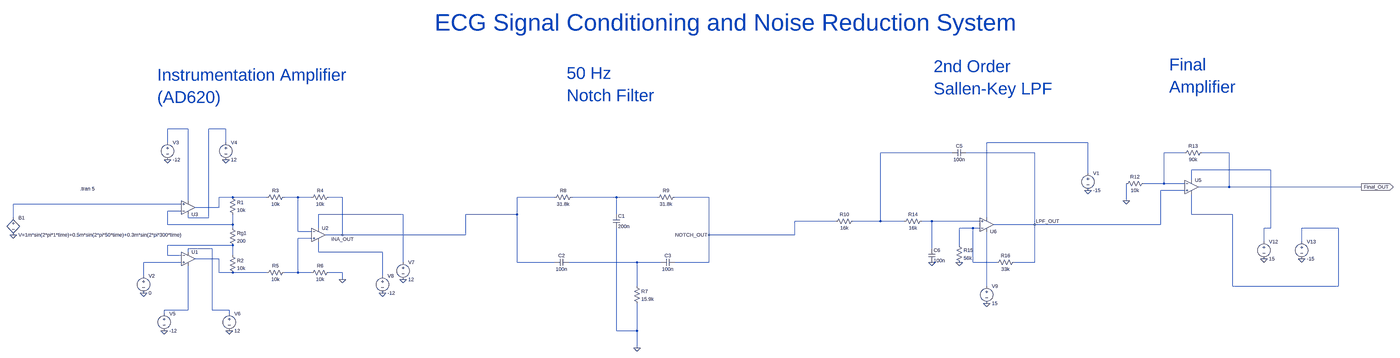
[diagram p0: schematic ECG_Final.asc, whole sheet]
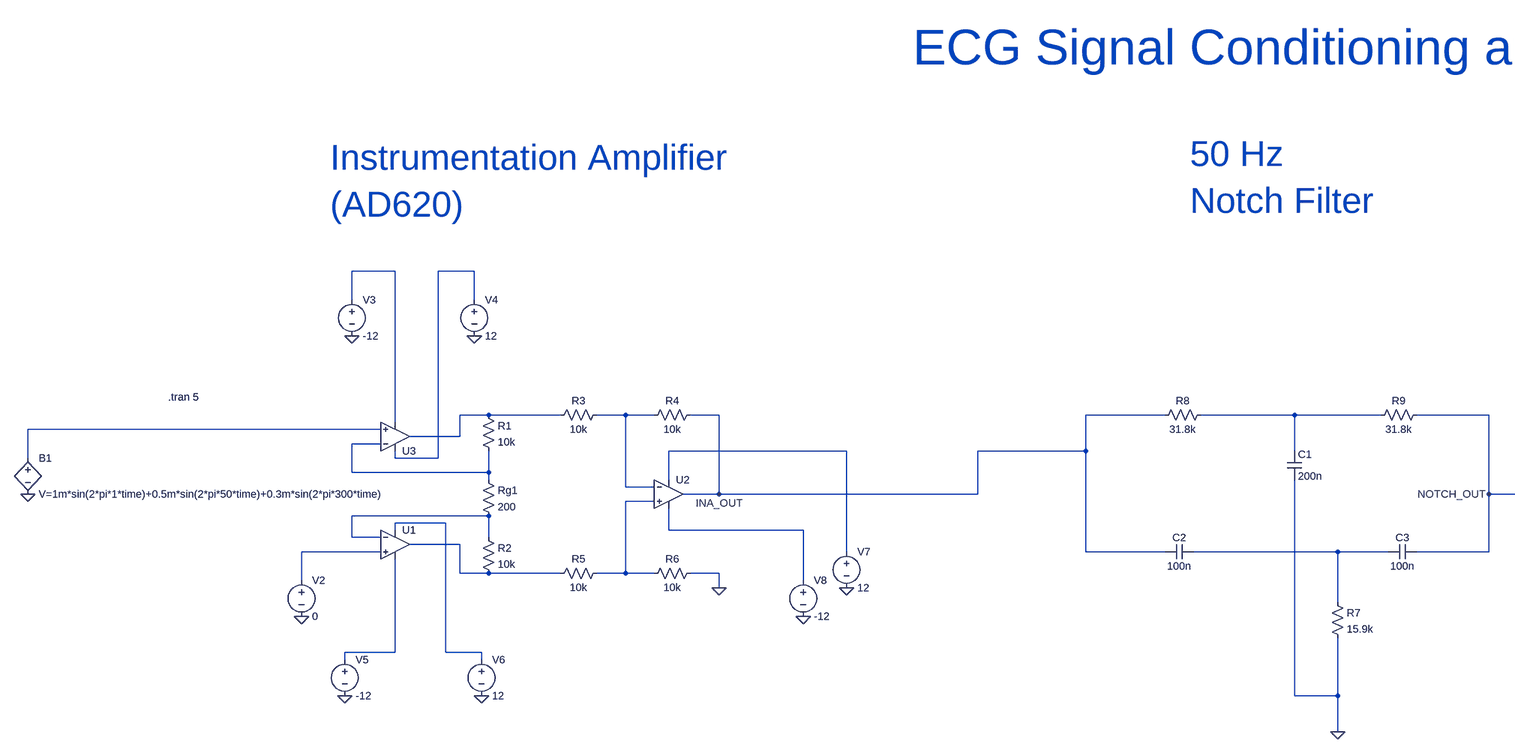
[diagram p1: schematic ECG_Final.asc, part, row 1 of 1, column 1 of 2]
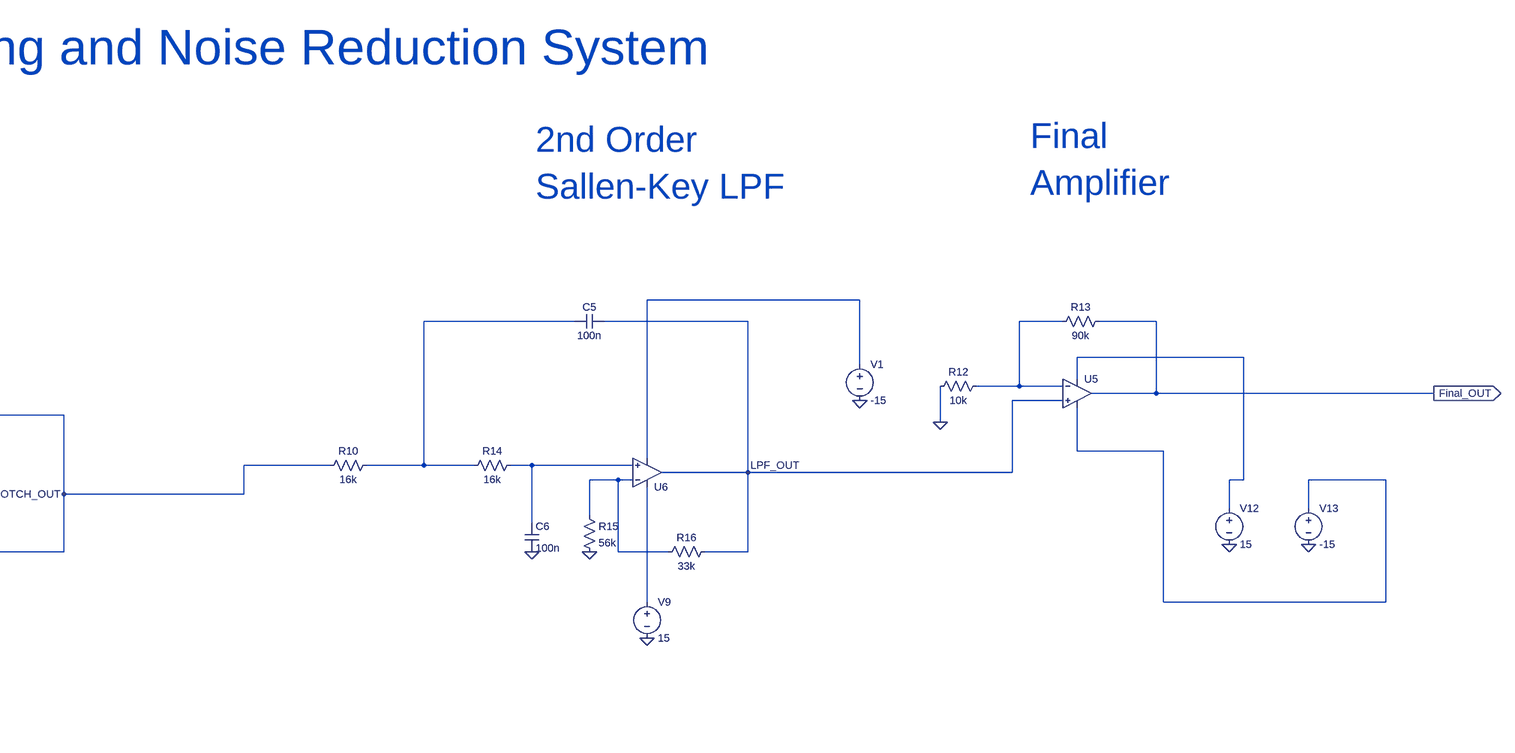
[diagram p2: schematic ECG_Final.asc, part, row 1 of 1, column 2 of 2]
ECG_Final.asc, the LTspice schematic file:
Version 4.1
SHEET 1 8388 680
WIRE -176 -368 -272 -368
WIRE 0 -368 -80 -368
WIRE -272 -304 -272 -368
WIRE 0 -304 0 -368
WIRE 4240 -304 3664 -304
WIRE 3504 -256 3168 -256
WIRE 3888 -256 3568 -256
WIRE 5056 -256 4960 -256
WIRE 5264 -256 5136 -256
WIRE 5488 -176 5088 -176
WIRE 4240 -160 4240 -304
WIRE 5088 -128 5088 -176
WIRE 4960 -112 4960 -256
WIRE 4960 -112 4864 -112
WIRE 5056 -112 4960 -112
WIRE 5264 -96 5264 -256
WIRE 5264 -96 5120 -96
WIRE 5952 -96 5264 -96
WIRE 5056 -80 4944 -80
WIRE 32 -48 -32 -48
WIRE 192 -48 32 -48
WIRE 336 -48 272 -48
WIRE 400 -48 336 -48
WIRE 544 -48 480 -48
WIRE 1648 -48 1472 -48
WIRE 1936 -48 1728 -48
WIRE 2128 -48 1936 -48
WIRE 2368 -48 2208 -48
WIRE -176 -32 -176 -368
WIRE 4784 -32 4784 -112
WIRE -208 -16 -992 -16
WIRE -32 0 -32 -48
WIRE -32 0 -144 0
WIRE -208 16 -272 16
WIRE 912 32 432 32
WIRE 1472 32 1472 -48
WIRE 1472 32 1232 32
WIRE 1936 32 1936 -48
WIRE 5088 32 5088 -64
WIRE 5280 32 5088 32
WIRE -992 48 -992 -16
WIRE -176 48 -176 32
WIRE -80 48 -80 -368
WIRE -80 48 -176 48
WIRE 3664 48 3664 -304
WIRE 2960 64 2768 64
WIRE 3168 64 3168 -256
WIRE 3168 64 3040 64
WIRE 3280 64 3168 64
WIRE 3408 64 3360 64
WIRE 3632 64 3408 64
WIRE -272 80 -272 16
WIRE 32 80 32 32
WIRE 32 80 -272 80
WIRE 3888 80 3888 -256
WIRE 3888 80 3696 80
WIRE 4944 80 4944 -80
WIRE 4944 80 3888 80
WIRE 32 96 32 80
WIRE 432 96 432 32
WIRE 3600 96 3536 96
WIRE 3632 96 3600 96
WIRE 5488 96 5488 -176
WIRE 5488 96 5456 96
WIRE 5824 96 5632 96
WIRE 336 112 336 -48
WIRE 400 112 336 112
WIRE 544 128 544 -48
WIRE 544 128 464 128
WIRE 1232 128 1232 32
WIRE 1232 128 544 128
WIRE 2368 128 2368 -48
WIRE 2768 128 2768 64
WIRE 2768 128 2368 128
WIRE 400 144 336 144
WIRE 5456 160 5456 96
WIRE 5632 160 5632 96
WIRE 32 176 -272 176
WIRE 3536 176 3536 96
WIRE -64 192 -176 192
WIRE 3408 192 3408 64
WIRE -176 208 -176 192
WIRE 432 208 432 160
WIRE 816 208 432 208
WIRE -272 224 -272 176
WIRE -208 224 -272 224
WIRE 32 224 32 176
WIRE -32 240 -144 240
WIRE -208 256 -384 256
WIRE 912 256 912 32
WIRE 1472 256 1472 32
WIRE 1648 256 1472 256
WIRE 2032 256 1712 256
WIRE 2144 256 2032 256
WIRE 2368 256 2368 128
WIRE 2368 256 2208 256
WIRE 3600 256 3600 96
WIRE 3712 256 3600 256
WIRE 3888 256 3888 80
WIRE 3888 256 3792 256
WIRE -32 304 -32 240
WIRE 32 304 -32 304
WIRE 192 304 32 304
WIRE 336 304 336 144
WIRE 336 304 272 304
WIRE 400 304 336 304
WIRE 544 304 480 304
WIRE -384 320 -384 256
WIRE 816 320 816 208
WIRE 544 336 544 304
WIRE 2032 368 2032 256
WIRE 3664 368 3664 112
WIRE 5280 368 5280 32
WIRE 5824 368 5824 96
WIRE 5824 368 5280 368
WIRE -176 480 -176 272
WIRE -176 480 -288 480
WIRE -64 480 -64 192
WIRE 16 480 -64 480
WIRE -288 496 -288 480
WIRE 16 496 16 480
WIRE 1936 576 1936 96
WIRE 2032 576 2032 448
WIRE 2032 576 1936 576
WIRE 2032 656 2032 576
FLAG 544 336 0
FLAG -384 400 0
FLAG -272 -224 0
FLAG 0 -224 0
FLAG -288 576 0
FLAG 16 576 0
FLAG 816 400 0
FLAG 912 336 0
FLAG 4784 -32 0
FLAG 5456 240 0
FLAG 5632 240 0
FLAG 2032 656 0
FLAG 544 128 INA_OUT
FLAG -992 128 0
FLAG 3408 256 0
FLAG 3536 256 0
FLAG 3664 448 0
FLAG 4240 -80 0
FLAG 3888 80 LPF_OUT
FLAG 5952 -96 Final_OUT
IOPIN 5952 -96 Out
FLAG 2368 128 NOTCH_OUT
SYMBOL res 16 -64 R0
SYMATTR InstName R1
SYMATTR Value 10k
SYMBOL res 16 80 R0
SYMATTR InstName Rg1
SYMATTR Value 200
SYMBOL res 16 208 R0
SYMATTR InstName R2
SYMATTR Value 10k
SYMBOL res 288 -64 R90
WINDOW 0 0 56 VBottom 2
WINDOW 3 32 56 VTop 2
SYMATTR InstName R3
SYMATTR Value 10k
SYMBOL res 496 -64 R90
WINDOW 0 0 56 VBottom 2
WINDOW 3 32 56 VTop 2
SYMATTR InstName R4
SYMATTR Value 10k
SYMBOL res 288 288 R90
WINDOW 0 0 56 VBottom 2
WINDOW 3 32 56 VTop 2
SYMATTR InstName R5
SYMATTR Value 10k
SYMBOL OpAmps\\UniversalOpAmp2 -176 240 R0
SYMATTR InstName U1
SYMBOL OpAmps\\UniversalOpAmp2 432 128 R0
SYMATTR InstName U2
SYMBOL res 496 288 R90
WINDOW 0 0 56 VBottom 2
WINDOW 3 32 56 VTop 2
SYMATTR InstName R6
SYMATTR Value 10k
SYMBOL OpAmps\\UniversalOpAmp2 -176 0 M180
SYMATTR InstName U3
SYMBOL voltage -384 304 R0
WINDOW 123 0 0 Left 0
WINDOW 39 0 0 Left 0
SYMATTR InstName V2
SYMATTR Value 0
SYMBOL voltage -272 -320 R0
WINDOW 123 0 0 Left 0
WINDOW 39 0 0 Left 0
SYMATTR InstName V3
SYMATTR Value -12
SYMBOL voltage 0 -320 R0
WINDOW 123 0 0 Left 0
WINDOW 39 0 0 Left 0
SYMATTR InstName V4
SYMATTR Value 12
SYMBOL voltage -288 480 R0
WINDOW 123 0 0 Left 0
WINDOW 39 0 0 Left 0
SYMATTR InstName V5
SYMATTR Value -12
SYMBOL voltage 16 480 R0
WINDOW 123 0 0 Left 0
WINDOW 39 0 0 Left 0
SYMATTR InstName V6
SYMATTR Value 12
SYMBOL voltage 912 240 R0
WINDOW 123 0 0 Left 0
WINDOW 39 0 0 Left 0
SYMATTR InstName V7
SYMATTR Value 12
SYMBOL voltage 816 304 R0
WINDOW 123 0 0 Left 0
WINDOW 39 0 0 Left 0
SYMATTR InstName V8
SYMATTR Value -12
SYMBOL res 1744 -64 R90
WINDOW 0 0 56 VBottom 2
WINDOW 3 32 56 VTop 2
SYMATTR InstName R8
SYMATTR Value 31.8k
SYMBOL res 2224 -64 R90
WINDOW 0 0 56 VBottom 2
WINDOW 3 32 56 VTop 2
SYMATTR InstName R9
SYMATTR Value 31.8k
SYMBOL cap 1712 240 R90
WINDOW 0 0 32 VBottom 2
WINDOW 3 32 32 VTop 2
SYMATTR InstName C2
SYMATTR Value 100n
SYMBOL cap 2208 240 R90
WINDOW 0 0 32 VBottom 2
WINDOW 3 32 32 VTop 2
SYMATTR InstName C3
SYMATTR Value 100n
SYMBOL res 4880 -128 R90
WINDOW 0 0 56 VBottom 2
WINDOW 3 32 56 VTop 2
SYMATTR InstName R12
SYMATTR Value 10k
SYMBOL res 5152 -272 R90
WINDOW 0 0 56 VBottom 2
WINDOW 3 32 56 VTop 2
SYMATTR InstName R13
SYMATTR Value 90k
SYMBOL voltage 5456 144 R0
SYMATTR InstName V12
SYMATTR Value 15
SYMBOL voltage 5632 144 R0
SYMATTR InstName V13
SYMATTR Value -15
SYMBOL OpAmps\\UniversalOpAmp2 5088 -96 R0
SYMATTR InstName U5
SYMBOL cap 1920 32 R0
SYMATTR InstName C1
SYMATTR Value 200n
SYMBOL res 2016 352 R0
SYMATTR InstName R7
SYMATTR Value 15.9k
SYMBOL bv -992 32 R0
SYMATTR InstName B1
SYMATTR Value V=1m*sin(2*pi*1*time)+0.5m*sin(2*pi*50*time)+0.3m*sin(2*pi*300*time)
SYMBOL res 3056 48 R90
WINDOW 0 0 56 VBottom 2
WINDOW 3 32 56 VTop 2
SYMATTR InstName R10
SYMATTR Value 16k
SYMBOL res 3376 48 R90
WINDOW 0 0 56 VBottom 2
WINDOW 3 32 56 VTop 2
SYMATTR InstName R14
SYMATTR Value 16k
SYMBOL cap 3568 -272 R90
WINDOW 0 0 32 VBottom 2
WINDOW 3 32 32 VTop 2
SYMATTR InstName C5
SYMATTR Value 100n
SYMBOL OpAmps\\UniversalOpAmp2 3664 80 M180
SYMATTR InstName U6
SYMBOL cap 3392 192 R0
SYMATTR InstName C6
SYMATTR Value 100n
SYMBOL res 3520 160 R0
SYMATTR InstName R15
SYMATTR Value 56k
SYMBOL res 3808 240 R90
WINDOW 0 0 56 VBottom 2
WINDOW 3 32 56 VTop 2
SYMATTR InstName R16
SYMATTR Value 33k
SYMBOL voltage 4240 -176 R0
SYMATTR InstName V1
SYMATTR Value -15
SYMBOL voltage 3664 352 R0
SYMATTR InstName V9
SYMATTR Value 15
TEXT -680 -88 Left 2 !.tran 5
TEXT -320 -712 Left 6 ;Instrumentation Amplifier\n(AD620)
TEXT 1704 -720 Left 6 ;50 Hz\nNotch Filter
TEXT 3416 -752 Left 6 ;2nd Order\nSallen-Key LPF
TEXT 4984 -760 Left 6 ;Final\nAmplifier
TEXT 1088 -1296 Left 7 ;ECG Signal Conditioning and Noise Reduction System

The netlist it stands for:
* ECG_Final.asc
R1 N007 N011 10k
Rg1 N011 N017 200
R2 N017 N020 10k
R3 N008 N007 10k
R4 INA_OUT N008 10k
R5 N016 N020 10k
X§U1 N021 N017 N018 N024 N020 level2 Avol=1Meg GBW=10Meg Slew=10Meg Ilimit=25m Rail=0 Vos=0 En=0 Enk=0 In=0 Ink=0 Rin=500Meg  ; pins In+ In- V+ V- OUT
X§U2 N016 N008 N012 N019 INA_OUT level2 Avol=1Meg GBW=10Meg Slew=10Meg Ilimit=25m Rail=0 Vos=0 En=0 Enk=0 In=0 Ink=0 Rin=500Meg  ; pins In+ In- V+ V- OUT
R6 0 N016 10k
X§U3 N010 N011 N002 N001 N007 level2 Avol=1Meg GBW=10Meg Slew=10Meg Ilimit=25m Rail=0 Vos=0 En=0 Enk=0 In=0 Ink=0 Rin=500Meg  ; pins In+ In- V+ V- OUT
V2 N021 0 0
V3 N001 0 -12
V4 N002 0 12
V5 N024 0 -12
V6 N018 0 12
V7 N012 0 12
V8 N019 0 -12
R8 N009 INA_OUT 31.8k
R9 NOTCH_OUT N009 31.8k
C2 N022 INA_OUT 100n
C3 NOTCH_OUT N022 100n
R12 N005 0 10k
R13 Final_OUT N005 90k
V12 N006 0 15
V13 N013 0 -15
X§U5 LPF_OUT N005 N006 N013 Final_OUT level2 Avol=1Meg GBW=10Meg Slew=10Meg Ilimit=25m Rail=0 Vos=0 En=0 Enk=0 In=0 Ink=0 Rin=500Meg  ; pins In+ In- V+ V- OUT
C1 N009 0 200n
R7 N022 0 15.9k
B1 N010 0 V=1m*sin(2*pi*1*time)+0.5m*sin(2*pi*50*time)+0.3m*sin(2*pi*300*time)
R10 N004 NOTCH_OUT 16k
R14 N014 N004 16k
C5 LPF_OUT N004 100n
X§U6 N014 N015 N023 N003 LPF_OUT level2 Avol=1Meg GBW=10Meg Slew=10Meg Ilimit=25m Rail=0 Vos=0 En=0 Enk=0 In=0 Ink=0 Rin=500Meg  ; pins In+ In- V+ V- OUT
C6 N014 0 100n
R15 N015 0 56k
R16 LPF_OUT N015 33k
V1 N003 0 -15
V9 N023 0 15
.tran 5
* Instrumentation Amplifier
* (AD620)
* 50 Hz
* Notch Filter
* 2nd Order
* Sallen-Key LPF
* Final
* Amplifier
* ECG Signal Conditioning and Noise Reduction System
.lib UniversalOpAmp2.lib
.backanno
.end